# EAGLE design Final_Bread_Proofing_Box_2020_05_07_A (EAGLE 9.6.1)

## Sheet 1 of 2
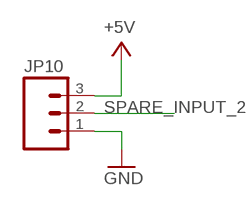
[diagram p0: schematic, sheet 1, part 1 of 2]
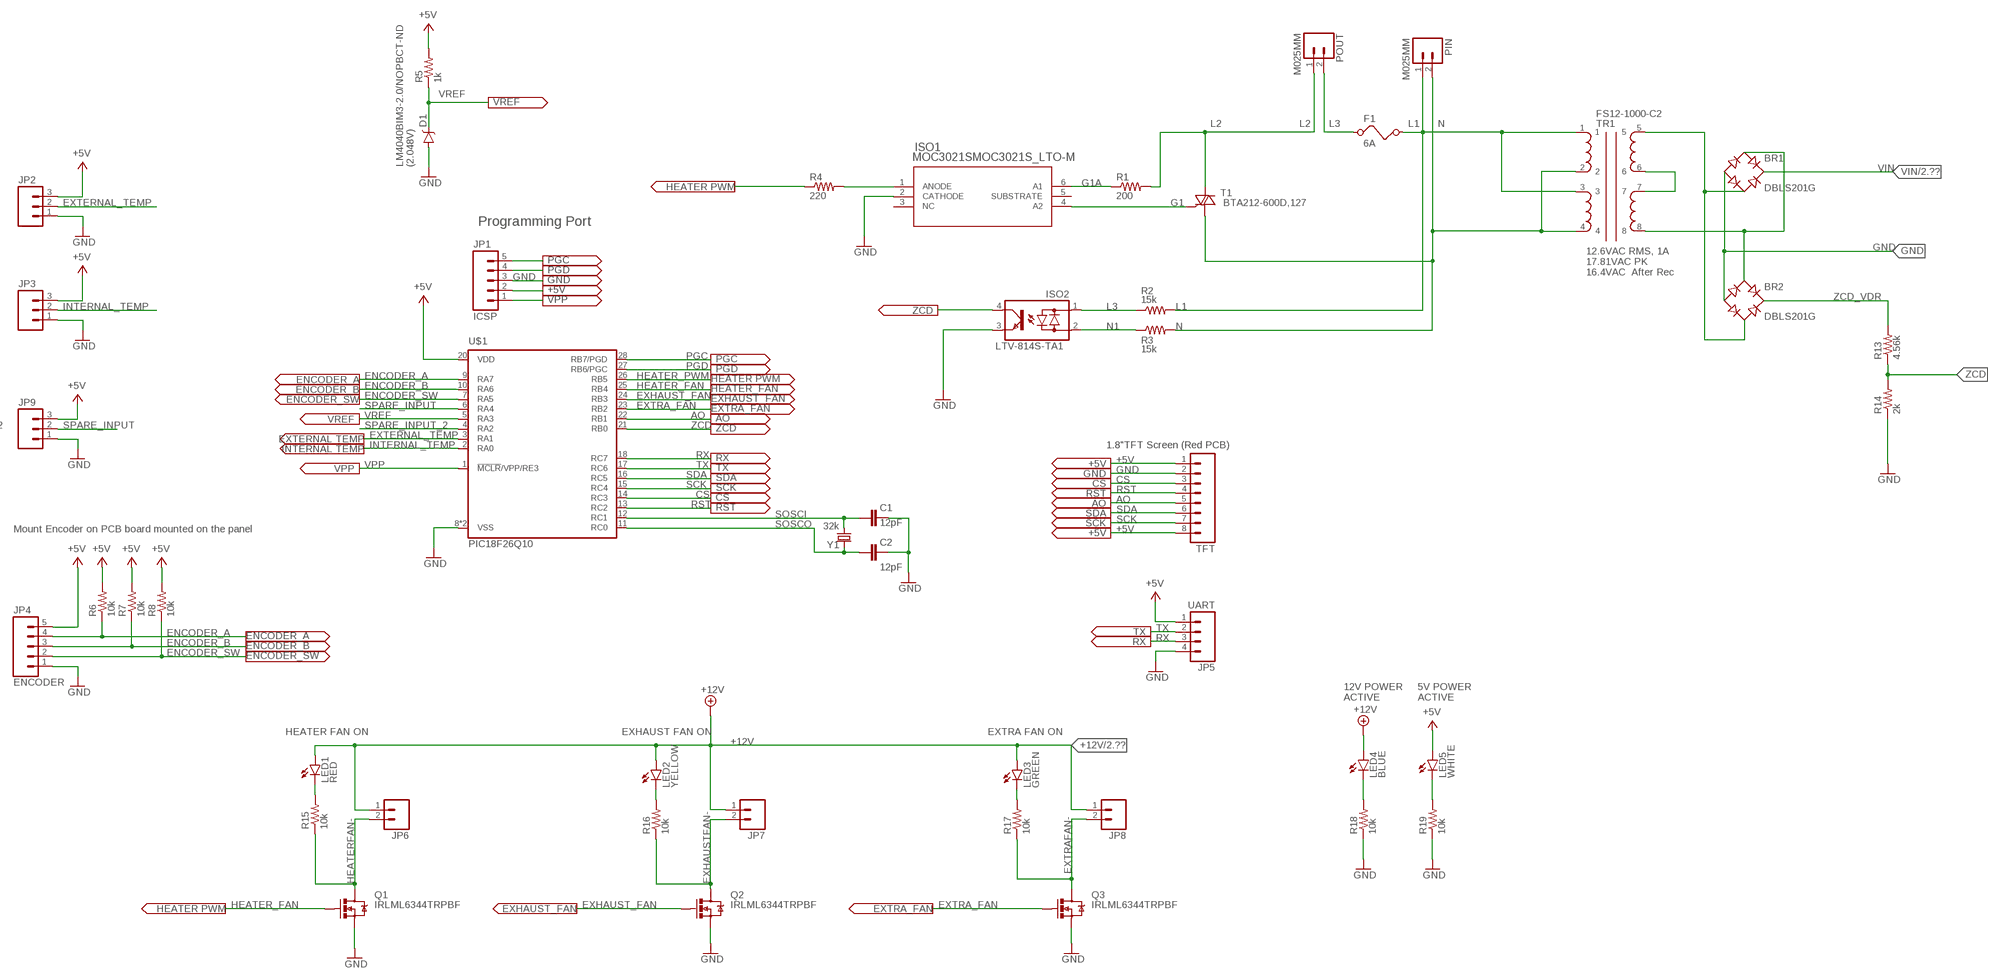
[diagram p1: schematic, sheet 1, part 2 of 2]

### Parts
BR1  DBLS201G  [DBS]
BR2  DBLS201G  [DBS]
C1  12pF  CAP0805  [0805]
C2  12pF  CAP0805  [0805]
D1  V-REFERENCESMD  [SOT23-3]
F1  6A  FUSE  [FUSE]
ISO1  MOC3021SMOC3021S_LTO-M  [MOC3021S_LTO-M]
ISO2  LTV-814S-TA1  SFH6206  [DIL4-SMD]
JP1  ICSP  M05PTH  [1X05]
JP2  M03POLAR  [MOLEX-1X3]
JP3  M03POLAR  [MOLEX-1X3]
JP4  ENCODER  M05PTH  [1X05]
JP5  UART  M04LOCK  [1X04_LOCK]
JP6  M02POLAR_LOCK  [MOLEX-1X2_LOCK]
JP7  M02POLAR_LOCK  [MOLEX-1X2_LOCK]
JP8  M02POLAR_LOCK  [MOLEX-1X2_LOCK]
JP9  M03POLAR  [MOLEX-1X3]
JP10  M03POLAR  [MOLEX-1X3]
LED1  RED  LED1206  [LED-1206]
LED2  YELLOW  LED1206  [LED-1206]
LED3  GREEN  LED1206  [LED-1206]
LED4  BLUE  LED1206  [LED-1206]
LED5  WHITE  LED1206  [LED-1206]
PIN  M025MM  [SCREWTERMINAL-5MM-2]
POUT  M025MM  [SCREWTERMINAL-5MM-2]
Q1  IRLML6344TRPBF  MOSFET-NCHANNEL2N7002PW  [SOT323]
Q2  IRLML6344TRPBF  MOSFET-NCHANNEL2N7002PW  [SOT323]
Q3  IRLML6344TRPBF  MOSFET-NCHANNEL2N7002PW  [SOT323]
R1  200  R-US_R2512  [R2512]
R2  15k  R-US_R2512  [R2512]
R3  15k  R-US_R2512  [R2512]
R4  220  RESISTOR1206  [1206]
R5  1k  RESISTOR1206  [1206]
R6  10k  RESISTOR1206  [1206]
R7  10k  RESISTOR1206  [1206]
R8  10k  RESISTOR1206  [1206]
R13  4.56k  RESISTOR1206  [1206]
R14  2k  RESISTOR1206  [1206]
R15  10k  RESISTOR1206  [1206]
R16  10k  RESISTOR1206  [1206]
R17  10k  RESISTOR1206  [1206]
R18  10k  RESISTOR1206  [1206]
R19  10k  RESISTOR1206  [1206]
T1  BTA212-600D,127  BT138-V  [TO220BV]
TFT  M08LOCK  [1X08_LOCK]
TR1  FS12-1000-C2  [FS12-1000-C2]
U$1  PIC18F26Q10  PIC18F25K22SOIC  [SO28W]
Y1  32k  CRYSTALTC26V  [TC26V]

### Nets
+5V: JP1.2 JP2.3 JP3.3 JP4.5 JP5.1 JP9.3 JP10.3 LED5.A R5.2 R6.2 R7.2 R8.2 TFT.1 TFT.8 U$1.20(VDD) ; also sheet 2
+12V: JP6.1 JP7.1 JP8.1 LED1.A LED2.A LED3.A LED4.A ; also sheet 2
AO: TFT.5 U$1.22(RB1)
CS: TFT.3 U$1.14(RC3)
ENCODER_A: JP4.4 R6.1 U$1.9(RA7)
ENCODER_B: JP4.3 R7.1 U$1.10(RA6)
ENCODER_SW: JP4.2 R8.1 U$1.7(RA5)
EXHAUST_FAN: Q2.1(G) U$1.24(RB3)
EXHAUSTFAN-: JP7.2 Q2.3(D) R16.1
EXTERNAL_TEMP: JP2.2 U$1.3(RA1)
EXTRA_FAN: Q3.1(G) U$1.23(RB2)
EXTRAFAN-: JP8.2 Q3.3(D) R17.1
G1: ISO1.4(A2) T1.G
G1A: ISO1.6(A1) R1.1
GND: BR1.- BR2.- C1.2 C2.2 D1.2(A) ISO1.2(CATHODE) ISO2.3(E) JP1.3 JP2.1 JP3.1 JP4.1 JP5.4 JP9.1 JP10.1 Q1.2(S) Q2.2(S) Q3.2(S) R14.1 R18.1 R19.1 TFT.2 U$1.8(VSS) U$1.19(VSS) ; also sheet 2
HEATER_FAN: Q1.1(G) U$1.25(RB4)
HEATER_PWM: R4.1 U$1.26(RB5)
HEATERFAN-: JP6.2 Q1.3(D) R15.1
INTERNAL_TEMP: JP3.2 U$1.2(RA0)
L1: F1.2 PIN.1 R2.2 TR1.1 TR1.3
L2: POUT.1 R1.2 T1.T2(A2)
L3: F1.1 ISO2.1(AC1) POUT.2 R2.1
N: PIN.2 R3.2 T1.T1(A1) TR1.2 TR1.4
N1: ISO2.2(AC2) R3.1
N$1: ISO1.1(ANODE) R4.2
N$2: TR1.6 TR1.7
N$3: LED1.C R15.2
N$4: LED2.C R16.2
N$5: LED3.C R17.2
N$6: BR1.AC2 BR2.AC2 TR1.5
N$7: BR1.AC1 BR2.AC1 TR1.8
N$12: LED4.C R18.2
N$13: LED5.C R19.2
PGC: JP1.5 U$1.28(RB7/PGD)
PGD: JP1.4 U$1.27(RB6/PGC)
RST: TFT.4 U$1.13(RC2)
RX: JP5.3 U$1.18(RC7)
SCK: TFT.7 U$1.15(RC4)
SDA: TFT.6 U$1.16(RC5)
SOSCI: C1.1 U$1.12(RC1) Y1.1
SOSCO: C2.1 U$1.11(RC0) Y1.2
SPARE_INPUT: JP9.2 U$1.6(RA4)
SPARE_INPUT_2: JP10.2 U$1.4(RA2)
TX: JP5.2 U$1.17(RC6)
VIN: BR1.+ ; also sheet 2
VPP: JP1.1 U$1.1(!MCLR!/VPP/RE3)
VREF: D1.1(C) R5.1 U$1.5(RA3)
ZCD: ISO2.4(C) R13.1 R14.2 U$1.21(RB0)
ZCD_VDR: BR2.+ R13.2
Unconnected: ISO1.3(NC) ISO1.5(SUBSTRATE)

### Notes on the sheet
- LM4040BIM3-2.0/NOPBCT-ND
  (2.048V)
- Programming Port
- 12.6VAC RMS, 1A
  17.81VAC PK
  16.4VAC  After Rec
- 1.8"TFT Screen (Red PCB)
- Mount Encoder on PCB board mounted on the panel
- 12V POWER
  ACTIVE
- 5V POWER
  ACTIVE
- HEATER FAN ON | EXHAUST FAN ON | EXTRA FAN ON

## Sheet 2 of 2
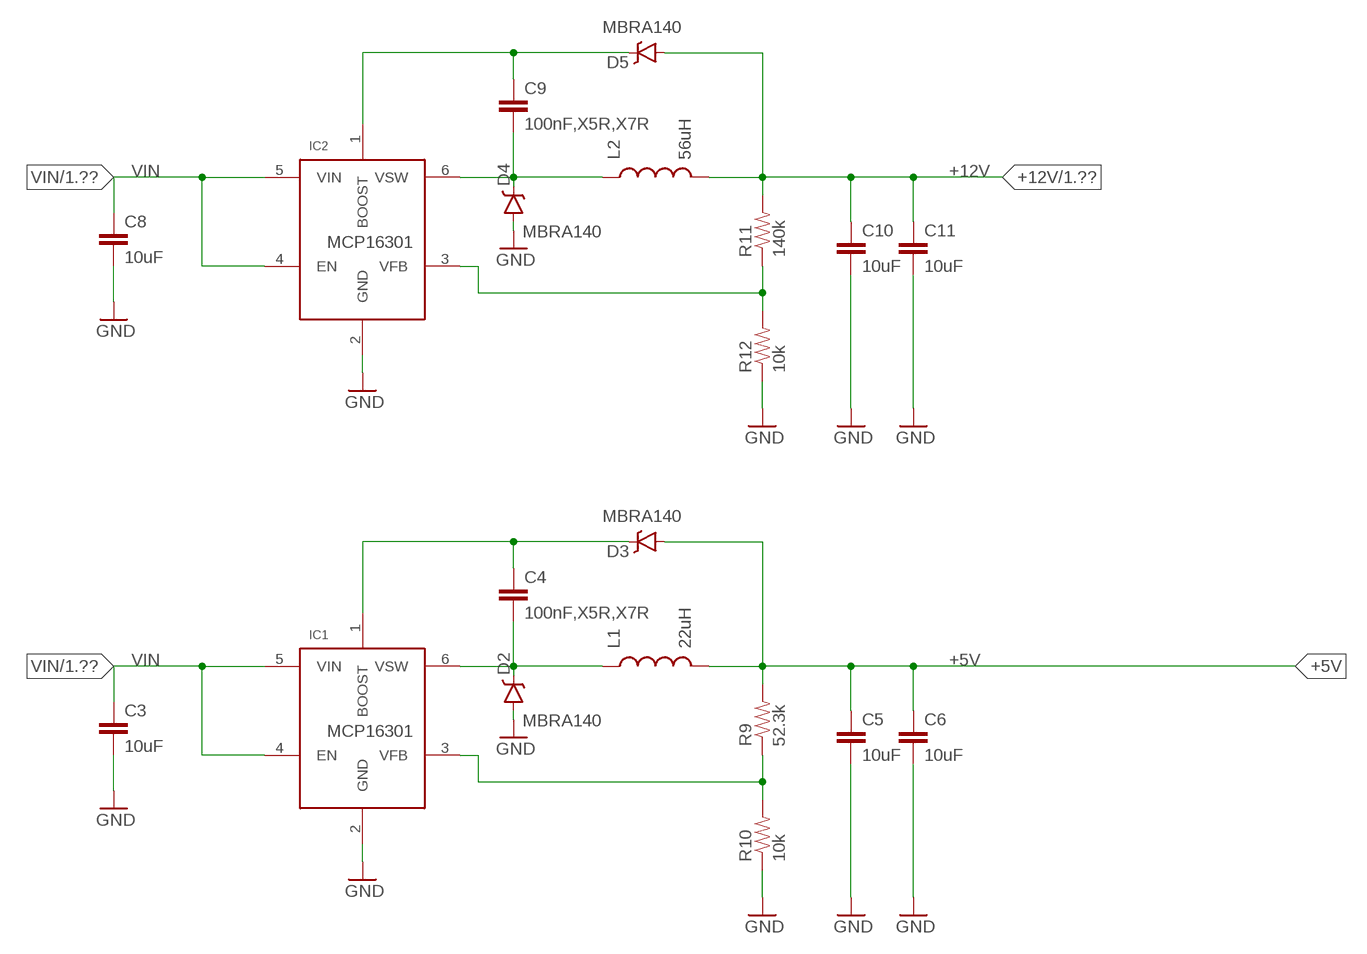
[diagram p2: schematic, sheet 2]

### Parts
C3  10uF  CAP1206  [1206]
C4  100nF,X5R,X7R  CAP1206  [1206]
C5  10uF  CAP1206  [1206]
C6  10uF  CAP1206  [1206]
C8  10uF  CAP1206  [1206]
C9  100nF,X5R,X7R  CAP1206  [1206]
C10  10uF  CAP1206  [1206]
C11  10uF  CAP1206  [1206]
D2  MBRA140  DIODE-SCHOTTKY-MBRA140  [SMA-DIODE]
D3  MBRA140  DIODE-SCHOTTKY-MBRA140  [SMA-DIODE]
D4  MBRA140  DIODE-SCHOTTKY-MBRA140  [SMA-DIODE]
D5  MBRA140  DIODE-SCHOTTKY-MBRA140  [SMA-DIODE]
IC1  MCP16301  [SOT23-6]
IC2  MCP16301  [SOT23-6]
L1  22uH  INDUCTOR1210  [1210]
L2  56uH  INDUCTOR1210  [1210]
R9  52.3k  RESISTOR1206  [1206]
R10  10k  RESISTOR1206  [1206]
R11  140k  RESISTOR1206  [1206]
R12  10k  RESISTOR1206  [1206]

### Nets
+5V: C5.1 C6.1 D3.A L1.2 R9.2 ; also sheet 1
+12V: C10.1 C11.1 D5.A L2.2 R11.2 ; also sheet 1
GND: C3.2 C5.2 C6.2 C8.2 C10.2 C11.2 D2.A D4.A IC1.2(GND) IC2.2(GND) R10.1 R12.1 ; also sheet 1
N$8: C9.1 D5.C IC2.1(BOOST)
N$9: C9.2 D4.C IC2.6(VSW) L2.1
N$10: IC2.3(VFB) R11.1 R12.2
N$11: C4.1 D3.C IC1.1(BOOST)
N$14: C4.2 D2.C IC1.6(VSW) L1.1
N$15: IC1.3(VFB) R9.1 R10.2
VIN: C3.1 C8.1 IC1.4(EN) IC1.5(VIN) IC2.4(EN) IC2.5(VIN) ; also sheet 1

### Notes on the sheet
- MCP16301
- MCP16301

## Library data of the parts
BR1 BR2 = rectifier:DB?*G: Single Phase 1.0 AMP Glass Passivated Bridge Rectifier Taiwan Semiconductor Co.,Ltd. - TSC Source: http://www.taiwansemi.com/TSCbig5/ezcatfiles/cust/img/img/db101g.pdf http://www.ts.com.tw/db/pictures/modules/PDT/PDT060207001/DBLS201G.pdf
C1-C6 C8-C11 = SparkFun-Capacitors:CAP: Capacitor Standard 0603 ceramic capacitor, and 0.1" leaded capacitor.
D1 = SparkFun-DiscreteSemi:V-REFERENCE: Zener diode
D2-D5 = SparkFun-DiscreteSemi:DIODE-SCHOTTKY: Schottky diodes in SFE's production catalog BAT20J 1A 23V 0.62Vf RB751 120mA 40V 0.37Vf PMEG4005EJ 0.5A 40V 0.42Vf MBRA140 1A 40V 0.5Vf B340A 3A 40V SMA; PROD_ID: DIO-08053
F1 = special:FUSE: FUSE 5 x 20 mm
IC1 IC2 = LM16301:MCP16301
ISO1 = MOC3021S:MOC3021S; BUILT_BY: EMA_Cory; COPYRIGHT: Copyright (C) 2018 Accelerated Designs. All rights reserved; MANUFACTURER_PART_NUMBER: MOC3021S; SOURCELIBRARY: Lite-On_2019-12-03; VENDOR: Lite-On
ISO2 = optocoupler:SFH620: Optocoupler, Phototransistor Output, AC Input Source: http://www.vishay.com/docs/83675/sfh620.pdf; MF: VISHAY/TELEFUNKEN; MPN: SFH6206-3; OC_FARNELL: 1469585; OC_NEWARK: 58K2214
JP1 JP4 = SparkFun-Connectors:M05: Header 5 Standard 5-pin 0.1" header. Use with straight break away headers (SKU : PRT-00116), right angle break away headers (PRT-00553), swiss pins (PRT-00743), machine pins (PRT-00117), and female headers (PRT-00115). Molex polarized connector foot print use with SKU : PRT-08230 with associated crimp pins and housings.
JP2 JP3 JP9 JP10 = SparkFun-Connectors:M03: Header 3 Standard 3-pin 0.1" header. Use with straight break away headers (SKU : PRT-00116), right angle break away headers (PRT-00553), swiss pins (PRT-00743), machine pins (PRT-00117), and female headers (PRT-00115). Molex polarized connector foot print use with SKU : PRT-08232 with associated crimp pins and housings.
JP5 = SparkFun-Connectors:M04: Header 4 Standard 4-pin 0.1" header. Use with straight break away headers (SKU : PRT-00116), right angle break away headers (PRT-00553), swiss pins (PRT-00743), machine pins (PRT-00117), and female headers (PRT-00115). Molex polarized connector foot print use with SKU : PRT-08231 with associated crimp pins and housings. 1MM SMD Version SKU: PRT-10208
JP6-JP8 = SparkFun-Connectors:M02: Standard 2-pin 0.1" header. Use with - straight break away headers ( PRT-00116) - right angle break away headers (PRT-00553) - swiss pins (PRT-00743) - machine pins (PRT-00117) - female headers (PRT-00115) Molex polarized connector foot print use with: PRT-08233 with associated crimp pins and housings. 2.54_SCREWTERM for use with PRT-10571. 3.5mm Screw Terminal footprints for PRT-08084 5mm Screw Terminal footprints for use with PRT-08432
L1 L2 = SparkFun-Passives:INDUCTOR: Inductors Basic Inductor/Choke - 0603 and 1206. Footprints are not proven and vary greatly between part numbers. SRN6045- 33uH, 20% 1.4A SDR0403-560KL - 56uH, 10%, 500mA RMS/740mA peak
LED1-LED5 = SparkFun-LED:LED: LEDs Standard schematic elements and footprints for 5mm, 3mm, 1206, and 0603 sized LEDs. 5mm - Spark Fun Electronics SKU : COM-00529 (and others)
PIN POUT = SparkFun-Connectors:M02: Standard 2-pin 0.1" header. Use with - straight break away headers ( PRT-00116) - right angle break away headers (PRT-00553) - swiss pins (PRT-00743) - machine pins (PRT-00117) - female headers (PRT-00115) Molex polarized connector foot print use with: PRT-08233 with associated crimp pins and housings. 2.54_SCREWTERM for use with PRT-10571. 3.5mm Screw Terminal footprints for PRT-08084 5mm Screw Terminal footprints for use with PRT-08432; STOREFRONT_ID: PRT-08432
Q1-Q3 = SparkFun-DiscreteSemi:MOSFET-NCHANNEL: Common NMOSFET Parts MFG P/N Store ID Prod ID FDD8780 TRANS-09984 SI7820DN TRANS-11055 FDS6630A IC-08089 2N7002PW TRANS-11151 FQP30N06L COM-10213 TRANS-10060 BSS123LT1G TRANS-08345 BSS138 TRANS-00830 BS170 2N7000; PROD_ID: TRANS-11151
R1-R3 = rcl:R-US_: RESISTOR, American symbol; SPICEPREFIX: R
R4-R19 = SparkFun-Resistors:RESISTOR: Resistor Basic schematic elements and footprints for 0603, 1206, and PTH resistors.
T1 = triac:BT138: TRIAC Source: http://www.semiconductors.philips.com BT138_SERIES_2.pdf
TFT = SparkFun-Connectors:M08: Header 8 Standard 8-pin 0.1" header. Use with straight break away headers (SKU : PRT-00116), right angle break away headers (PRT-00553), swiss pins (PRT-00743), machine pins (PRT-00117), and female headers (PRT-00115).
TR1 = f10-110-c2:FS12-1000-C2
U$1 = PIC18F25K22:PIC18F25K22
Y1 = adafruit:CRYSTAL: CRYSTAL; OC_FARNELL: unknown; OC_NEWARK: unknown

## Board
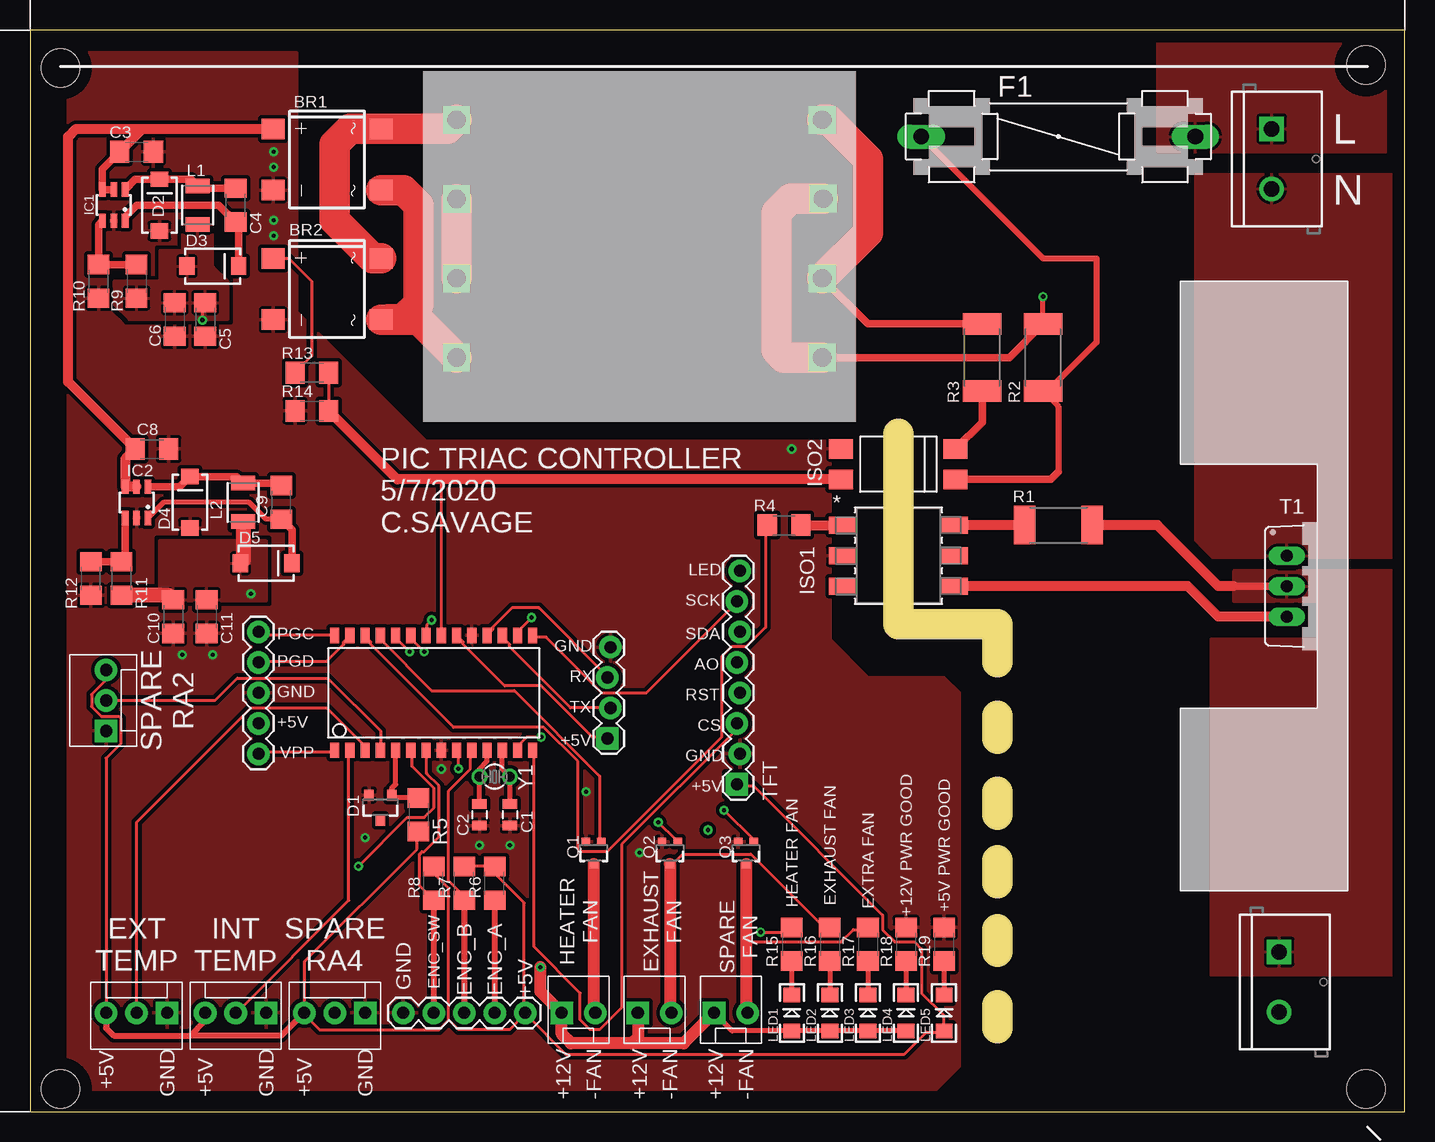
[diagram p3: board, top side]
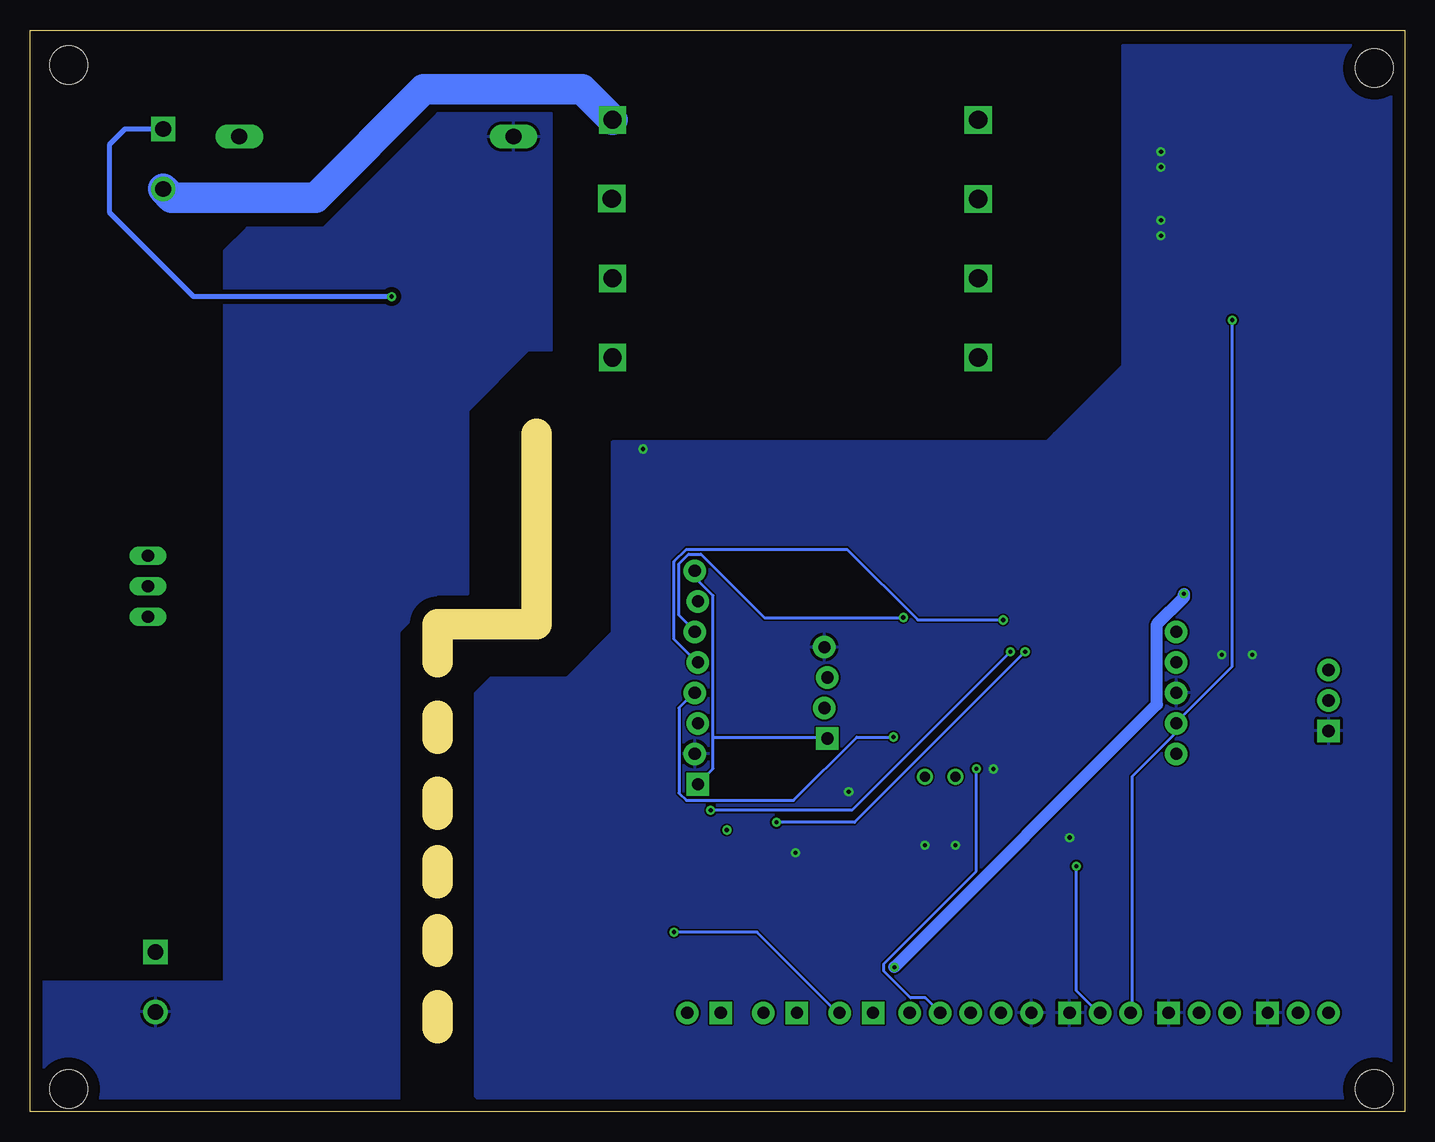
[diagram p4: board, bottom side, seen from below]

Size 114.61 x 90.16 mm. Coordinates in mm from the lower left corner, seen from the top.
Outline: 72.39,56.52 72.39,40.64 80.64,40.64 80.64,37.47
Outline: 80.64,33.02 80.64,31.11
Outline: 80.64,26.67 80.64,24.76
Outline: 80.64,20.95 80.64,19.05
Outline: 80.64,15.24 80.64,13.34
Outline: 80.64,8.89 80.64,6.98
Outline: 0,0 114.61,0 114.61,90.16 0,90.16 0,0
Copper layers (1*16): Top 0.035mm / dielectric 1.5mm / Bottom 0.035mm
Design rules "default": minimum track width 10mil, minimum drill 0.35mm, track to track 6mil, track to pad 6mil, pad to pad 6mil, via to via 6mil, smd to smd 6mil, copper to edge 40mil, drill to drill 6mil, minimum pad ring 10mil, minimum via ring 8mil, stop-mask expansion 4mil, vias tented up to drill 0mil, thermal gap 10mil
Holes 3.17 mm at 2.54,1.91 111.38,1.91 111.38,87.25 2.54,87
tKeepout: area 69.9,2.5 to 82.5,60.3
Milling: 10 lines

### Footprints (pad centres in the part's own frame; a part is rotated, then mirrored left to right if it is on the bottom)
DBS = smd 1.7 x 1.9: + -2.55,-4.5; - 2.55,-4.5; AC1 -2.55,4.5; AC2 2.55,4.5
0805 = smd 0.8 x 1.2: 1 -0.9,0; 2 0.9,0
1206 = smd 1.6 x 1.8: 1 -1.4,0; 2 1.4,0
SOT23-3 = smd 0.8 x 0.9: 1 -0.95,-1; 2 0.95,-1; 3 0,1.1
SMA-DIODE = smd 1.27 x 1.47: A -2.15,0; C 2.15,0
FUSE = drill 1.321 long: 1 -11.43,0; 2 11.43,0
SOT23-6 = smd 0.55 x 1.2: 1 0.95,-1.3; 2 0,-1.3; 3 -0.95,-1.3; 4 -0.95,1.3; 5 0,1.3; 6 0.95,1.3
MOC3021S_LTO-M = smd 2.261 x 1.397: 1 -4.661,2.54; 2 -4.661,0; 3 -4.661,-2.54; 4 4.661,-2.54; 5 4.661,0; 6 4.661,2.54
DIL4-SMD = smd 1.6 x 2: 1 -1.27,-4.77; 2 1.27,-4.77; 3 1.27,4.77; 4 -1.27,4.77
1X05 = drill 1.016 pad 1.88: 1 0,0; 2 2.54,0; 3 5.08,0; 4 7.62,0; 5 10.16,0
MOLEX-1X3 = drill 1.016 pad 1.88 square: 1 0,0 | drill 1.016 pad 1.88: 2 2.54,0; 3 5.08,0
1X04_LOCK = drill 1.016 pad 1.88 square: 1 0,0.127 | drill 1.016 pad 1.88: 2 2.54,-0.127; 3 5.08,0.127; 4 7.62,-0.127
MOLEX-1X2_LOCK = drill 1.016 pad 1.88 square: 1 -0.127,0 | drill 1.016 pad 1.88: 2 2.667,0
1210 = smd 1.2 x 2: 1 -1.6,0; 2 1.6,0
LED-1206 = smd 1.2 x 1.4: A -1.5,0; C 1.5,0
SCREWTERMINAL-5MM-2 = drill 1.3 pad 2.032 square: 1 0,0 | drill 1.3 pad 2.032: 2 5,0
SOT323 = smd 0.7 x 0.7: 1 -0.65,-0.925; 2 0.65,-0.925; 3 0,0.925
R2512 = smd 1.8 x 3.2: 1 -2.8,0; 2 2.8,0
TO220BV = drill 1.016 long: G 2.54,-2.54; T1 -2.54,-2.54; T2 0,-2.54
1X08_LOCK = drill 1.016 pad 1.88 square: 1 0,0.127 | drill 1.016 pad 1.88: 2 2.54,-0.127; 3 5.08,0.127; 4 7.62,-0.127; 5 10.16,0.127; 6 12.7,-0.127; 7 15.24,0.127; 8 17.78,-0.127
FS12-1000-C2 = drill 1.524 square: 1 30.48,0; 2 30.48,6.604; 3 30.556,13.241; 4 30.48,19.812; 5 0,0; 6 0,6.604; 7 0,13.208; 8 0,19.812
SO28W = smd 0.762 x 1.27: 1 -7.62,-4.78; 2 -6.35,-4.78; 3 -5.08,-4.78; 4 -3.81,-4.78; 5 -2.54,-4.78; 6 -1.27,-4.78; 7 0,-4.78; 8 1.27,-4.78; 9 2.54,-4.78; 10 3.81,-4.78; 11 5.08,-4.78; 12 6.35,-4.78; 13 7.62,-4.78; 14 8.89,-4.78; 15 8.89,4.78; 16 7.62,4.78; 17 6.35,4.78; 18 5.08,4.78; 19 3.81,4.78; 20 2.54,4.78; 21 1.27,4.78; 22 0,4.78; 23 -1.27,4.78; 24 -2.54,4.78; 25 -3.81,4.78; 26 -5.08,4.78; 27 -6.35,4.78; 28 -7.62,4.78
TC26V = drill 0.813: 1 -1.27,0; 2 1.27,0

### Placement (x,y rotation side)
BR1  24.76,79.38 270 top
BR2  24.76,68.58 270 top
C1  40.01,24.76 270 top
C2  37.47,24.76 270 top
C3  8.89,80.01 0 top
C4  17.14,75.56 90 top
C5  14.61,66.04 270 top
C6  12.07,66.04 270 top
C8  10.16,55.25 0 top
C9  20.95,50.8 90 top
C10  11.94,41.28 270 top
C11  14.73,41.28 270 top
D1  29.21,25.4 180 top
D2  10.79,75.56 90 top
D3  15.24,70.48 0 top
D4  13.34,50.8 90 top
D5  19.68,45.72 0 top
F1  85.73,81.28 0 top
HEATSINK  [7-345-2PP-BA]  109.86,43.82 90 top
IC1  6.98,75.56 0 top
IC2  8.89,50.8 0 top
ISO1  72.39,46.36 0 top
ISO2  72.39,53.98 90 top
JP1  19.05,29.84 90 top
JP2  11.43,8.26 180 top
JP3  19.68,8.26 180 top
JP4  31.11,8.26 0 top
JP5  48.26,31.11 90 top
JP6  44.45,8.26 0 top
JP7  50.8,8.26 0 top
JP8  57.15,8.26 0 top
JP9  27.94,8.26 180 top
JP10  6.35,31.75 90 top
L1  13.97,75.56 270 top
L2  17.78,50.8 270 top
LED1  63.5,8.26 90 top
LED2  66.67,8.26 90 top
LED3  69.85,8.26 90 top
LED4  73.03,8.26 90 top
LED5  76.2,8.26 90 top
PIN  103.5,81.92 270 top
POUT  104.14,13.34 270 top
Q1  46.99,21.59 180 top
Q2  53.34,21.59 180 top
Q3  59.69,21.59 180 top
R1  85.73,48.9 0 top
R2  84.45,62.87 90 top
R3  79.38,62.87 90 top
R4  62.87,48.9 0 top
R5  32.38,24.76 270 top
R6  38.73,19.05 90 top
R7  36.2,19.05 90 top
R8  33.66,19.05 90 top
R9  8.89,69.22 270 top
R10  5.71,69.22 90 top
R11  7.62,44.45 270 top
R12  5.08,44.45 90 top
R13  23.49,61.59 180 top
R14  23.49,58.42 0 top
R15  63.5,13.97 270 top
R16  66.67,13.97 270 top
R17  69.85,13.97 270 top
R18  73.03,13.97 270 top
R19  76.2,13.97 270 top
T1  107.31,43.82 270 top
TFT  59.05,27.3 90 top
TR1  35.56,62.87 0 top
U$1  33.02,34.92 0 top
Y1  38.73,27.94 180 top

### Tracks (layer width: path | path; a pad name or v marks a point on that pad's centre or on a via)
+5V  (via drill 0.35)
  Top 0.254: U$1.20 35.71,39.57 36.12,39.17 36.12,38.96 39.57,35.51 42.62,35.51 46.89,31.24 48.11,31.24 JP5.1 | TFT.1 59.08,27.18 60.3,27.18 71.07,16.41 71.07,15.19 72.09,14.17 73.71,14.17 74.32,13.56 74.32,9.91 76.15,8.08 76.15,6.86 LED5.A 76.15,6.66 74.73,6.66 72.9,4.83 44.65,4.83 41.4,8.08 JP4.5 | R7.2 36.32,20.47 38.56,20.47 R6.2 38.76,20.27 38.76,19.86 41.2,17.42 41.2,8.28 JP4.5 | 34.9,7.67 34.9,18.64 33.68,19.86 33.68,20.27 R8.2 | 34.9,7.67 35.71,6.86 39.98,6.86 41.2,8.08 JP4.5 | R5.2 32.26,23.32 32.26,21.89 22.91,12.55 22.91,8.48 JP9.3 22.91,8.08 24.13,6.86 34.09,6.86 34.9,7.67 | v14.38,65.99 14.38,67.21 C5.1 | JP10.3 6.35,36.01 5.13,34.8 5.13,33.79 5.95,32.97 7.41,32.97 7.57,32.81 7.57,30.69 6.35,29.47 JP2.3
  Top 0.508: JP2.3 6.35,6.98 6.98,6.35 13.34,6.35 | 13.34,6.35 14.61,7.62 JP3.3 | JP9.3 20.95,6.35 13.34,6.35
  Bottom 0.254: 57.66,31.24 57.66,28.6 58.88,27.38 TFT.1 | 57.66,31.24 57.66,43.03 59.08,44.45 59.08,45.06 TFT.8 | 57.66,31.24 48.31,31.24 JP5.1 | JP9.3 22.71,8.28 22.71,27.99 19.05,31.65 JP1.2 19.05,32.46 14.38,37.14 v14.38,65.99
  pour Top (isolate 0.305): 10.79,69.22 6.98,69.22 6.98,67.31 8.26,66.04 16.51,66.04 16.51,69.22 15.24,70.48 15.24,74.3 12.7,74.3 12.7,71.75 10.79,71.75
+12V  (via drill 0.35)
  Top 0.254: C10.1 11.56,43.05
  Top 0.406: LED4.A LED3.A LED2.A LED1.A 58.52,6.75 JP8.1
  Top 1.016: JP8.1 54.48,5.71 50.16,5.71 | 50.16,5.71 45.09,5.71 44.32,6.48 JP6.1 42.55,10.03 v42.55,12.07 | JP7.1 50.67,6.22 50.16,5.71
  Top 1.27: D5.A 17.78,45.97 L2.2 | 11.56,43.05 R11.2
  Bottom 1.016: v42.55,12.07 20.65,33.96 20.65,40.67 18.41,42.9 v18.41,43.18
  pour Top (isolate 0.254): 10.79,47.62 19.68,47.62 19.68,42.55 10.79,42.55
AO  (via drill 0.35)
  Top 0.254: v33.48,41 33.07,40.59 33.07,39.78 U$1.22
  Bottom 0.254: v33.48,41 40.59,41 46.48,46.89 59.89,46.89 60.91,45.87 60.91,39.37 59.08,37.54 TFT.5
CS
  Top 0.254: U$1.14 42.01,30.02 42.01,13.77 45.87,9.91 45.87,7.67 46.69,6.86 47.5,6.86 49.33,8.69 49.33,22.3 58.88,31.85 58.88,32.26 TFT.3
ENCODER_A  (via drill 0.35)
  Top 0.254: v35.71,28.6 35.71,30.02 U$1.9
  Top 0.508: R6.1 JP4.4
  Bottom 0.254: v35.71,28.6 35.71,20.07 43.43,12.34 43.43,11.73 41.2,9.5 39.98,9.5 JP4.4
ENCODER_B
  Top 0.254: U$1.10 36.73,30.02 36.73,28.6 34.9,26.77 34.9,19.25 36.32,17.83 R7.1
  Top 0.508: R7.1 JP4.3
ENCODER_SW
  Top 0.254: U$1.7 33.07,30.02 33.07,28.19 34.09,27.18 34.09,22.91 32.87,21.69 32.66,21.69 32.46,21.49 32.46,18.85 33.48,17.83 R8.1
  Top 0.508: R8.1 JP4.2
EXHAUST_FAN  (via drill 0.35)
  Top 0.254: v52.38,24.13 53.8,22.71 Q2.1 | v31.65,38.35 30.43,39.57 U$1.24
  Bottom 0.254: v52.38,24.13 45.87,24.13 v31.65,38.35
EXHAUSTFAN-
  Top 0.254: R16.1 66.6,15.39 66.19,15.39 60.1,21.49 54.41,21.49 53.8,20.88 Q2.3
  Top 1.016: Q2.3 53.34,8.38 JP7.2
EXTERNAL_TEMP
  Top 0.254: JP2.2 8.89,24.13 18.44,33.68 24.74,33.68 27.79,30.63 27.79,30.23 U$1.3
EXTRA_FAN  (via drill 0.35)
  Top 0.254: v57.86,25.15 60.3,22.71 Q3.1 | v32.87,38.35 31.65,39.57 U$1.23
  Bottom 0.254: v57.86,25.15 46.08,25.15 v32.87,38.35
EXTRAFAN-
  Top 0.254: 59.69,14.17 67.61,14.17 68.63,15.19 69.85,15.19 R17.1
  Top 1.016: Q3.3 59.69,14.17 59.69,8.38 JP8.2
G1
  Top 0.61: 77.47,43.82 ISO1.4
  Top 0.813: T1.G 99.06,41.28 96.52,43.82 77.47,43.82
G1A
  Top 0.61: 77.47,48.9 ISO1.6
  Top 0.813: R1.1 77.47,48.9
GND  (via drill 0.35)
  other vias: 37.47,22.22 40.01,22.22 34.29,28.57 27.94,22.86 20.32,80.01 20.32,78.74 20.32,74.3 20.32,73.03 12.7,38.1 15.24,38.1 46.36,26.67 50.8,21.59 63.5,55.25
  pour Top (isolate 0.305, rank 2): 3.17,88.27 3.17,2.54 3.81,1.91 75.56,1.91 77.47,3.81 77.47,34.92 76.2,36.2 69.85,36.2 66.67,39.37 66.67,55.88 33.02,55.88 22.22,66.67 22.22,88.27
  pour Bottom: 3.81,0 73.03,0 76.2,0 77.47,1.27 77.47,34.92 76.2,36.2 69.85,36.2 66.04,40.01 66.04,55.88 29.84,55.88 29.21,56.52 23.49,62.23 23.49,88.9 -0.64,88.9 -0.64,0
HEATER_FAN
  Top 0.254: U$1.25 29.21,39.37 33.48,35.1 40.39,35.1 47.5,27.99 47.5,22.71 Q1.1
HEATER_PWM
  Top 0.254: U$1.26 27.99,39.57 28.4,39.17 28.4,38.96 35.31,32.05 42.82,32.05 45.67,29.21 45.67,21.89 45.87,21.69 48.11,21.69 57.66,31.24 57.66,37.95 58.47,38.76 59.69,38.76 61.32,40.39 61.32,48.72 R4.1
HEATERFAN-  (via drill 0.35)
  Top 0.254: v60.91,14.99 62.94,14.99 R15.1
  Top 1.016: Q1.3 46.99,8.38 JP6.2
  Bottom 0.254: v60.91,14.99 54,14.99 47.3,8.28 JP6.2
INTERNAL_TEMP
  Top 0.254: U$1.2 26.57,30.02 26.57,17.63 17.22,8.28 JP3.2
L1  (via drill 0.35)
  Top 0.406: R2.2 v84.45,67.95
  Top 0.61: R2.2 81.66,62.87 TR1.1
  Top 2.54: TR1.3 63.41,76.11 62.23,74.93 62.23,63.5 62.87,62.87 TR1.1
  Bottom 0.406: v84.45,67.95 100.97,67.95 107.95,74.93 107.95,80.64 106.68,81.92 PIN.1
  pour Top (isolate 0.406): 93.98,80.01 113.03,80.01 113.03,89.53 93.98,89.53
L2
  Top 0.61: T1.T2 100.33,43.82
  Top 0.813: 100.33,43.82 99.06,43.82 93.98,48.9 R1.2
  pour Top (isolate 0.406): 113.67,45.09 100.33,45.09 100.33,42.55 107.31,42.55 107.31,39.37 98.42,39.37 98.42,11.43 113.67,11.43
L3
  Top 0.508: F1.1 84.45,71.12 88.9,71.12 88.9,64.14 84.45,59.69 | R2.1 85.73,58.8 85.73,53.34
  Top 0.61: 84.45,59.69 R2.1 | 85.73,53.34 85.09,52.71 ISO2.1
  pour Bottom (isolate 0.406): 98.42,10.79 114.94,10.79 114.94,-0.64 83.82,-0.64 83.82,40.01 80.64,43.18 78.11,43.18 78.11,58.42 73.03,63.5 71.12,63.5 71.12,83.19 80.64,83.19 90.17,73.66 96.52,73.66 98.42,71.75
N
  Top 0.61: R3.2 69.84,65.66 TR1.2
  Top 2.54: TR1.2 69.85,73.28 69.85,79.38 66.55,82.68 TR1.4
  Bottom 2.54: TR1.4 68.58,85.22 81.79,85.22 90.81,76.2 102.79,76.2 PIN.2
  pour Top (isolate 0.813): 97.16,46.23 114.3,46.23 114.3,78.11 97.16,78.11
N1
  Top 0.61: ISO2.2 79.38,57.46 R3.1
N$1
  Top 0.406: R4.2 ISO1.1 67.95,48.9
  Top 0.813: R4.2 67.95,48.9
N$2
  Top 2.54: TR1.6 TR1.7
N$3
  Top 0.406: LED1.C R15.2
N$4
  Top 0.406: R16.2 LED2.C
N$5
  Top 0.406: R17.2 LED3.C
N$6
  Top 0.254: BR2.AC2 29.21,65.99 29.84,66.04
  Top 2.54: BR1.AC2 31.12,76.83 32.38,75.56 32.38,67.31 31.11,66.04 29.84,66.04 | TR1.5 32.4,66.03 BR2.AC2
N$7
  Top 2.54: BR2.AC1 28.56,71.13 25.4,74.3 25.4,80.64 26.68,81.92 BR1.AC1 34.81,81.92 TR1.8
N$8
  Top 0.406: C9.1 19.68,49.4 18.28,50.8 11.14,50.8 IC2.1
  Top 0.61: C9.1 21.83,48.52 D5.C
N$9
  Top 0.61: IC2.6 12.49,52.1 D4.C 17.23,52.95 L2.1 20.75,52.4 C9.2
N$10
  Top 0.61: IC2.3 7.94,46.17 R11.1 R12.2
N$11
  Top 0.61: IC1.1 7.94,74.61 8.89,75.56 15.75,75.56 C4.1 17.39,73.92 D3.C
N$12
  Top 0.406: R18.2 LED4.C
N$13
  Top 0.406: R19.2 LED5.C
N$14
  Top 0.254: C4.2 16.76,76.97
  Top 0.61: IC1.6 8.79,77.72 D2.C 13.42,77.72 L1.1 14.17,76.97 16.76,76.97
N$15
  Top 0.61: IC1.3 5.71,73.95 R10.2 R9.1
N$18  (via drill 0.35)
  other vias: 56.52,23.49
PGC
  Top 0.254: U$1.28 25.35,39.78 19.25,39.78 19.05,39.98 JP1.5
PGD
  Top 0.254: U$1.27 26.57,39.57 26.16,39.17 26.16,38.96 24.74,37.54 19.05,37.54 JP1.4
RST  (via drill 0.35)
  Top 0.254: v42.62,31.24 41.4,31.24 40.79,30.63 40.79,30.23 U$1.13
  Bottom 0.254: v42.62,31.24 45.67,31.24 50.95,25.96 59.89,25.96 60.5,26.57 60.5,33.68 59.28,34.9 TFT.4
RX
  Top 0.254: U$1.18 38.15,39.78 38.56,40.18 38.56,40.39 40.18,42.01 42.42,42.01 48.11,36.32 JP5.3
SCK
  Top 0.254: U$1.15 42.01,39.57 43.03,39.57 47.7,34.9 51.36,34.9 58.88,42.42 TFT.7
SDA  (via drill 0.35)
  Top 0.254: v41.81,41.2 40.79,40.18 40.79,39.78 U$1.16
  Bottom 0.254: v41.81,41.2 53.39,41.2 58.67,46.48 59.69,46.48 60.5,45.67 60.5,41.4 59.28,40.18 TFT.6
SOSCI
  Top 0.406: U$1.12 39.37,28.57 Y1.1 C1.1
SOSCO
  Top 0.406: U$1.11 38.1,29.21 37.47,28.57 Y1.2 C2.1
SPARE_INPUT  (via drill 0.35)
  Top 0.254: v27.38,20.47 31.45,24.54 32.87,24.54 33.68,25.35 33.68,26.97 31.85,28.8 31.85,30.02 U$1.6
  Bottom 0.254: v27.38,20.47 27.38,10.11 25.55,8.28 JP9.2
SPARE_INPUT_2
  Top 0.254: JP10.2 15.42,34.29 17.27,36.14 24.82,36.14 29.21,31.75 U$1.4
TX
  Top 0.254: U$1.17 39.37,39.57 39.98,38.96 39.98,38.76 45.06,33.68 48.31,33.68 JP5.2
VIN
  Top 0.61: C3.1 6.04,78.56 IC1.4 IC1.5
  Top 0.813: 9.4,81.92 3.82,81.92 3.17,81.28 3.17,60.83 C8.1 7.94,54.43 IC2.4 IC2.5 | 9.4,81.92 BR1.+ | C3.1 9.4,81.92
VPP
  Top 0.254: U$1.1 25.35,30.02 19.05,30.02 JP1.1
VREF
  Top 0.406: U$1.5 30.48,27.3 30.16,26.98 D1.1 30.39,26.16 R5.1
ZCD
  Top 0.254: R13.1 R14.2 | 34.29,52.71 U$1.21
  Top 0.813: ISO2.4 34.29,52.71 30.61,52.71 R14.2
ZCD_VDR
  Top 0.254: BR2.+ 21.58,71.13 23.49,69.22 23.49,63 R13.2

### Text on the board
tNames: L | N | PIC TRIAC CONTROLLER / 5/7/2020 / C.SAVAGE | LED | SCK | PGC | SDA | GND | PGD | AO | RX | GND | SPARE / RA2 | RST | TX | +5V | CS | +5V | VPP | GND | +5V | HEATER FAN | EXHAUST FAN | +12V PWR GOOD | +5V PWR GOOD | EXTRA FAN | HEATER / FAN | EXHAUST / FAN | SPARE / FAN | EXT / TEMP | INT / TEMP | SPARE / RA4 | ENC_SW | ENC_B | ENC_A | GND | +5V | +12V | -FAN | +12V | -FAN | +12V | -FAN | +5V | GND | +5V | GND | +5V | GND
tValues: DANGER 120VAC! | LINE | DANGER 120VAC! | L | LOAD | N